# EAGLE design cosv-carrier-teensy40_old (EAGLE 9.6.2)
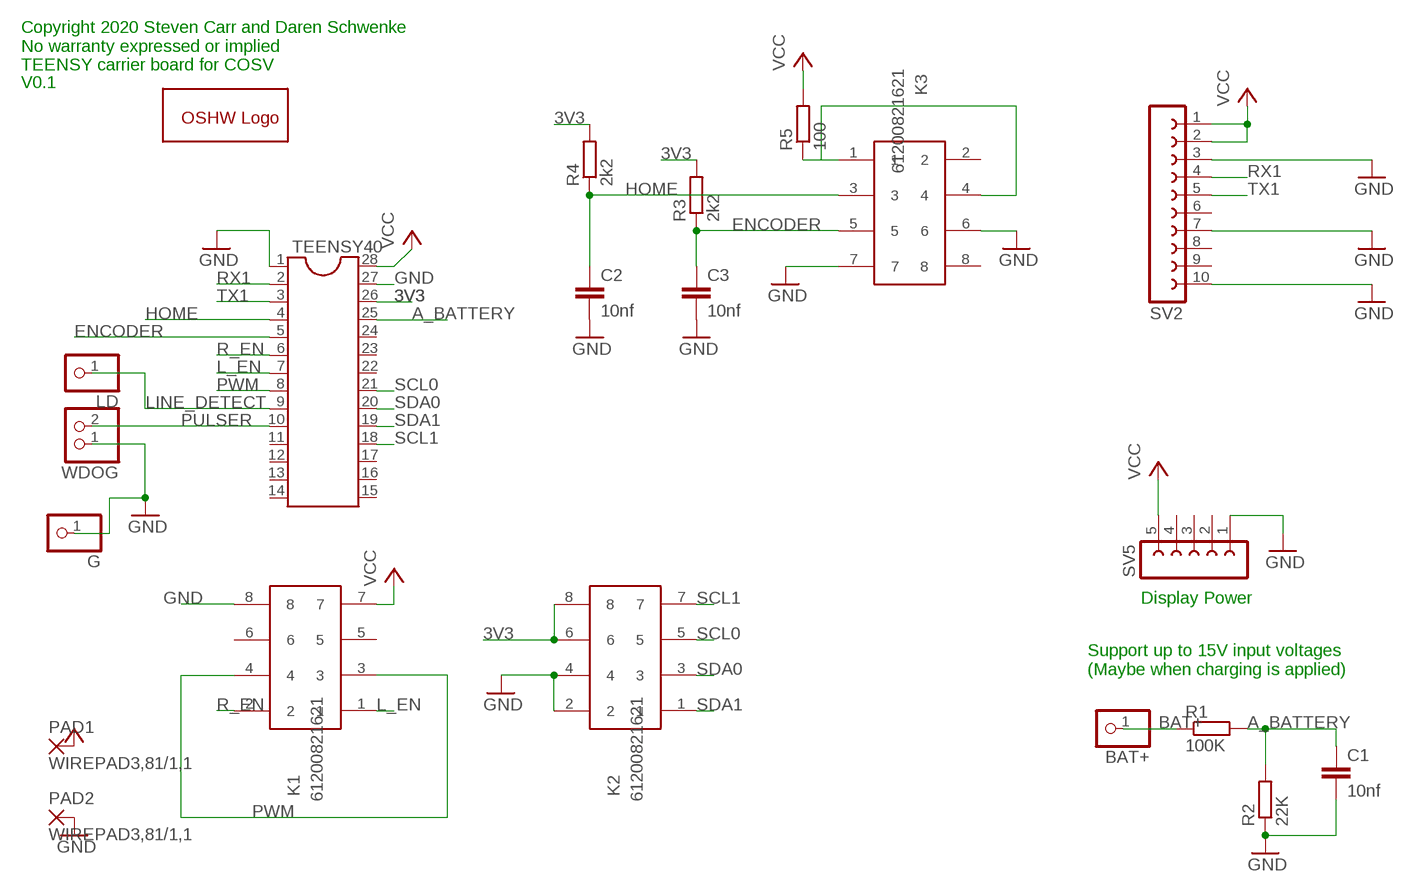
[diagram p0: schematic, sheet 1]

## Parts
BAT+  PINHD-1X01_2.54-S  [1X01-S]
C1  10nf  C-EUC1206  [C1206]
C2  10nf  C-EUC1206  [C1206]
C3  10nf  C-EUC1206  [C1206]
G  PINHD-1X01_2.54-S  [1X01-S]
GOLD_ORB_SM1  OSHWLOGOLOGO8MM  [OSHW_8MM]
K1  61200821621  [61200821621]
K2  61200821621  [61200821621]
K3  61200821621  [61200821621]
LD  PINHD-1X01_2.54-S  [1X01-S]
PAD1  WIREPAD3,81/1,1  [3,81/1,1]
PAD2  WIREPAD3,81/1,1  [3,81/1,1]
R1  100K  R-EU_R1206  [R1206]
R2  22K  R-EU_R1206  [R1206]
R3  2k2  R-EU_R1206  [R1206]
R4  2k2  R-EU_R1206  [R1206]
R5  100  R-EU_R1206  [R1206]
SV2  FE10-1  [FE10]
SV5  FE05W  [FE05W]
TEENSY40  DIL28  [DIL28-6]
WDOG  PINHD-1X2  [1X02]

## Nets
3V3: K2.6 K2.8 R3.2 R4.2 TEENSY40.26
A_BATTERY: C1.1 R1.2 R2.2 TEENSY40.25
BAT+: BAT+.1 R1.1
ENCODER: C3.1 K3.5 R3.1 TEENSY40.5
GND: C1.2 C2.2 C3.2 G.1 K1.8 K2.2 K2.4 K3.6 K3.7 PAD2.1(P) R2.1 SV2.3 SV2.7 SV2.10 SV5.1 TEENSY40.1 TEENSY40.27 WDOG.1
HOME: C2.1 K3.3 R4.1 TEENSY40.4
L_EN: K1.1 TEENSY40.7
LINE_DETECT: LD.1 TEENSY40.9
N$1: K3.1 K3.4 R5.1
PULSER: TEENSY40.10 WDOG.2
PWM: K1.3 K1.4 TEENSY40.8
R_EN: K1.2 TEENSY40.6
RX1: SV2.4 TEENSY40.2
SCL0: K2.5 TEENSY40.21
SCL1: K2.7 TEENSY40.18
SDA0: K2.3 TEENSY40.20
SDA1: K2.1 TEENSY40.19
TX1: SV2.5 TEENSY40.3
VCC: K1.7 PAD1.1(P) R5.2 SV2.1 SV2.2 SV5.5 TEENSY40.28
Unconnected: K1.5 K1.6 K3.2 K3.8 SV2.6 SV2.8 SV2.9 SV5.2 SV5.3 SV5.4 TEENSY40.11 TEENSY40.12 TEENSY40.13 TEENSY40.14 TEENSY40.15 TEENSY40.16 TEENSY40.17 TEENSY40.22 TEENSY40.23 TEENSY40.24

## Notes on the sheet
- Copyright 2020 Steven Carr and Daren Schwenke
  No warranty expressed or implied
  TEENSY carrier board for COSV
- V0.1
- Display Power
- Support up to 15V input voltages
  (Maybe when charging is applied)

## Library data of the parts
BAT+ G LD = pinhead-2:PINHD-1X01: PIN HEADER
C1-C3 = rcl:C-EU: CAPACITOR, European symbol
GOLD_ORB_SM1 = oshw:OSHWLOGO: The OSHW logo for PCB layout
K1-K3 = Wuerth_Elektronik_eiCan_05_Box_Header_IDC_Connectors_1_2:61200821621: WR-BHD 2.54mm Male Box Header, 8 Pins
PAD1 PAD2 = wirepad:WIREPAD: Wire PAD connect wire on PCB
R1-R5 = resistor:R-EU_: RESISTOR, European symbol
SV2 = con-lsta:FE10-1: FEMALE HEADER; OC_FARNELL: unknown; OC_NEWARK: unknown
SV5 = con-lsta:FE05W: FEMALE HEADER; OC_FARNELL: unknown; OC_NEWARK: unknown
TEENSY40 = ic-package:DIL28: Dual In Line
WDOG = pinhead:PINHD-1X2: PIN HEADER

## Board
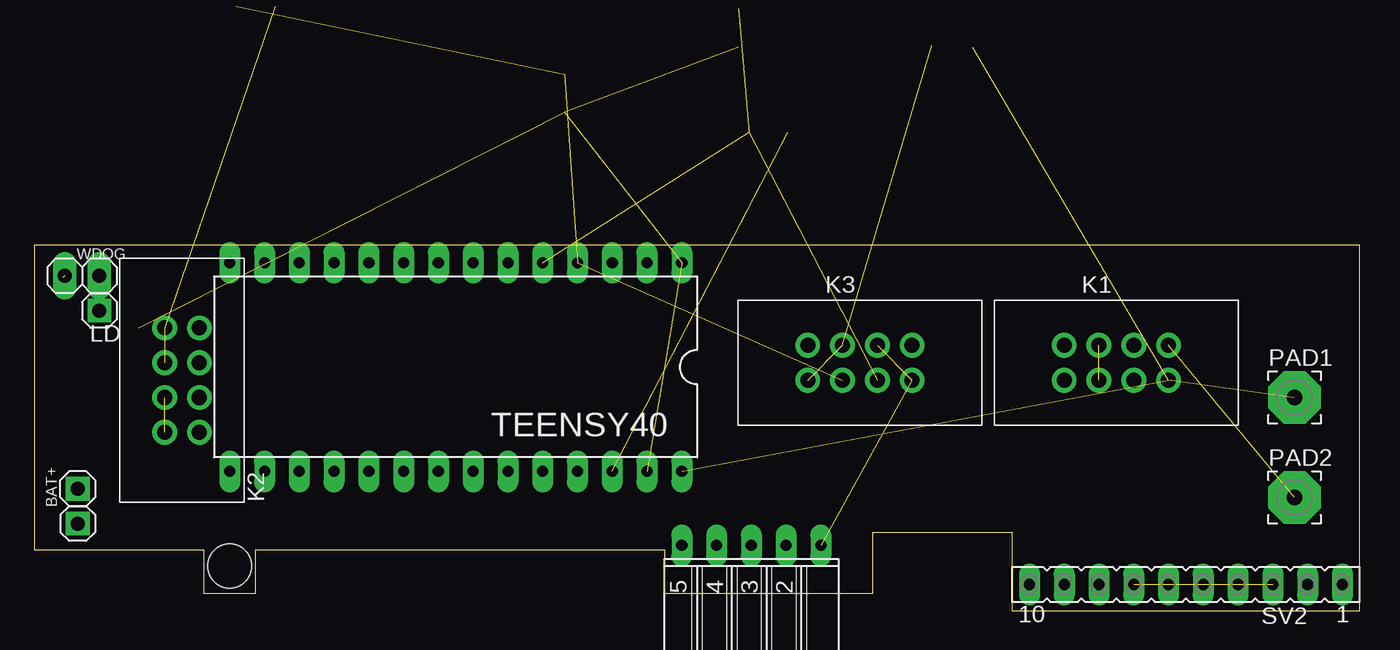
[diagram p1: board, top side]
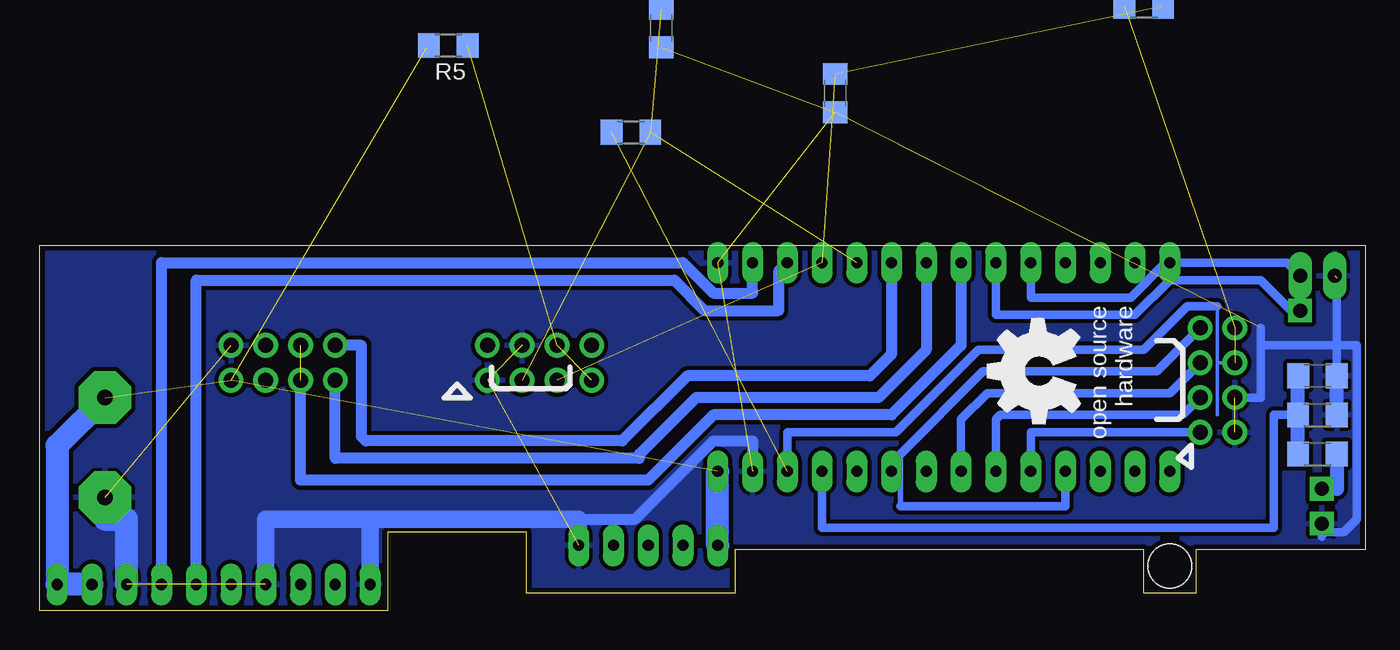
[diagram p2: board, bottom side, seen from below]

Size 96.84 x 26.67 mm. Coordinates in mm from the lower left corner, seen from the top.
Outline: 0,4.44 12.38,4.44 12.38,1.27 16.19,1.27 16.19,4.44 46.04,4.44 46.04,1.27 61.28,1.27 61.28,5.72 71.44,5.72 71.44,0 96.84,0 96.84,26.66 7,26.66 6.98,26.67 0,26.67 0,4.44
Copper layers (1*16): Top 0.035559375mm / dielectric 1.6mm / Bottom 0.035559375mm
Design rules "oshpark-2layer *": minimum track width 6mil, minimum drill 10mil, track to track 5mil, track to pad 5mil, pad to pad 5mil, via to via 5mil, smd to smd 5mil, copper to edge 15mil, drill to drill 6mil, minimum pad ring 14mil, minimum via ring 5mil, stop-mask expansion 2.5mil, vias tented up to drill 0mil, thermal gap 10mil
Holes 3.2 mm at 14.29,3.25

### Footprints (pad centres in the part's own frame; a part is rotated, then mirrored left to right if it is on the bottom)
1X01-S = drill 1.016 square: 1 0,0
C1206 = smd 1.6 x 1.8: 1 -1.4,0; 2 1.4,0
61200821621 = drill 1.1: 1 -2.54,-1.27; 2 -2.54,1.27; 3 0,-1.27; 4 0,1.27; 5 2.54,-1.27; 6 2.54,1.27; 7 5.08,-1.27; 8 5.08,1.27
3,81/1,1 = drill 1.118 pad 3.81 octagon: 1 0,0
R1206 = smd 1.6 x 1.803: 1 -1.422,0; 2 1.422,0
FE10 = drill 0.813 long: 1 -11.43,0; 2 -8.89,0; 3 -6.35,0; 4 -3.81,0; 5 -1.27,0; 6 1.27,0; 7 3.81,0; 8 6.35,0; 9 8.89,0; 10 11.43,0
FE05W = drill 0.813 long: 1 -5.08,0; 2 -2.54,0; 3 0,0; 4 2.54,0; 5 5.08,0
DIL28-6 = drill 0.813 long: 1 -16.51,-7.62; 2 -13.97,-7.62; 3 -11.43,-7.62; 4 -8.89,-7.62; 5 -6.35,-7.62; 6 -3.81,-7.62; 7 -1.27,-7.62; 8 1.27,-7.62; 9 3.81,-7.62; 10 6.35,-7.62; 11 8.89,-7.62; 12 11.43,-7.62; 13 13.97,-7.62; 14 16.51,-7.62; 15 16.51,7.62; 16 13.97,7.62; 17 11.43,7.62; 18 8.89,7.62; 19 6.35,7.62; 20 3.81,7.62; 21 1.27,7.62; 22 -1.27,7.62; 23 -3.81,7.62; 24 -6.35,7.62; 25 -8.89,7.62; 26 -11.43,7.62; 27 -13.97,7.62; 28 -16.51,7.62
1X02 = drill 1.016 long: 1 -1.27,0; 2 1.27,0

### Placement (x,y rotation side)
BAT+  3.18,8.89 270 top
C1  3.49,17.15 0 bottom
C2  38.73,37.78 270 bottom  (outside the outline)
C3  51.44,42.55 270 bottom  (outside the outline)
G  3.18,6.35 0 top
GOLD_ORB_SM1  23.81,17.46 90 bottom
K1  77.79,18.1 0 top
K2  10.79,15.56 90 top
K3  59.05,18.1 0 top
LD  4.76,21.91 0 top
PAD1  92.07,15.56 0 top
PAD2  92.07,8.25 0 top
R1  3.49,11.43 180 bottom
R2  3.49,14.29 180 bottom
R3  53.66,34.93 180 bottom  (outside the outline)
R4  16.19,44.13 180 bottom  (outside the outline)
R5  66.99,41.27 180 bottom  (outside the outline)
SV2  84.14,1.91 180 top
SV5  52.39,4.76 180 top
TEENSY40  30.8,17.78 180 top
WDOG  3.49,24.45 0 top

### Tracks (layer width: path | path; a pad name or v marks a point on that pad's centre or on a via)
3V3  (3 unrouted)
  Bottom 0.254: 10.79,22.22 10.79,18.1 | K2.6 10.79,18.1 | 10.79,18.1 10.79,14.29
  Bottom 0.61: 10.79,22.22 13.02,22.22 16.19,19.05 28.26,19.05 34.29,13.02 42.23,13.02 TEENSY40.26
A_BATTERY
  Bottom 0.61: TEENSY40.25 39.69,6.03 6.67,6.03 6.67,14.29 5.4,14.29 | 5.4,14.44 5.4,14.29 | R2.2 5.4,14.29
  Bottom 1.016: 4.89,17.46 C1.1 4.91,17.12 R2.2 R1.2
BAT+
  Bottom 1.016: BAT+.1 2.07,8.89 R1.1
ENCODER  (3 unrouted)
GND  (10 unrouted)
  Bottom 0.61: 3.18,5.72 1.59,5.72 0.64,6.67 0.64,19.37 2.09,19.37 | 2.09,16.83 C1.2 2.09,19.24 2.22,19.37 | 7.62,20.64 7.62,19.37 | 7.62,19.37 7.62,15.56 K2.4 | 2.09,24.32 2.09,19.37 | 2.09,19.37 2.22,19.37 | 2.22,19.37 7.62,19.37 | G.1 3.18,5.72 | 3.18,5.72 3.18,5.4
  Bottom 0.813: 57.47,6.67 53.34,6.67 47.62,12.38 44.77,12.38 TEENSY40.27
  Bottom 1.016: R2.1 2.07,17.12 C1.2
  Bottom 1.27: 72.71,6.67 57.47,6.67 SV5.1 | 72.71,6.67 80.33,6.67 SV2.7 | SV2.10 72.71,6.67
  Bottom 1.676: SV2.3 90.49,6.67 92.07,6.67 PAD2.1
  pour Bottom (isolate 0.305): 0,4.45 0,26.67 97.15,26.67 97.15,-0.32 71.44,-0.32 71.44,5.71 61.28,5.71 61.28,1.27 46.04,1.27 46.04,4.45
HOME  (3 unrouted)
L_EN
  Bottom 0.813: K1.1 75.25,11.11 53.02,11.11 53.02,11.43 48.9,15.56 35.56,15.56 32.07,19.05 TEENSY40.7
LINE_DETECT
  Bottom 0.61: TEENSY40.9 26.99,21.59 16.83,21.59 14.29,24.13 7.62,24.13 5.4,21.91 LD.1
N$1  (2 unrouted)
PULSER
  Bottom 0.61: TEENSY40.10 24.45,22.86 17.14,22.86 14.61,25.4 5.71,25.4 WDOG.2
PWM  (1 unrouted)
  Bottom 0.813: TEENSY40.8 29.53,19.37 34.61,14.29 47.62,14.29 52.39,9.53 77.79,9.53 K1.3
R_EN
  Bottom 0.813: TEENSY40.6 34.61,18.73 36.2,17.15 49.53,17.15 54.29,12.38 73.02,12.38 73.34,12.7 73.34,19.37 K1.2
RX1
  Bottom 0.813: SV2.4 87.95,25.4 49.85,25.4 47.62,23.18 44.77,23.18 TEENSY40.2
SCL0
  Bottom 0.61: TEENSY40.21 29.53,13.97 27.62,15.87 14.29,15.87 K2.5
SCL1
  Bottom 0.406: 33.97,11.43 33.97,7.62
  Bottom 0.61: 33.97,7.62 21.91,7.62 TEENSY40.18 | 33.97,11.43 27.94,17.46 15.24,17.46 K2.7
SDA0
  Bottom 0.61: TEENSY40.20 26.99,13.97 26.67,14.29 13.34,14.29 K2.3
SDA1
  Bottom 0.61: K2.1 24.45,13.02 TEENSY40.19
TX1
  Bottom 0.813: SV2.5 85.41,24.13 50.48,24.13 48.26,21.91 42.86,21.91 42.86,24.76 TEENSY40.3
VCC  (3 unrouted)
  Bottom 0.813: R5.2 68.58,41.11
  Bottom 1.676: SV2.2 SV2.1 95.57,12.06 PAD1.1 | SV5.5 TEENSY40.28

### Text on the board
tValues: gnd | gnd | scl1 | 3v3 | scl0 | gnd | sda0 | vcc | PWM | gnd | enc | home | REN | 3v3 | 3v3 | sda1 | gnd | LEN | PWM | gnd | gnd | vcc
bValues: TEENSY 4.0 Carrier Board for COSV / (c) 2020 Steven Carr and Daren Schwenke | V0.1